# Altium schematic sheet power_supply.SchDoc
size A4
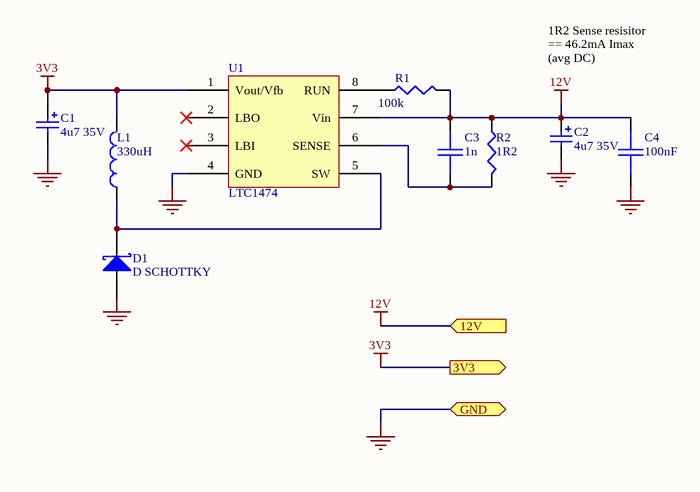
[diagram p0: power_supply.SchDoc]

## Parts
C1  4u7 35V  [MCCT-CASEC]
C2  4u7 35V  [MCCT-CASEC]
C3  1n  [0603]
C4  100nF  [0603]
D1  D SCHOTTKY  [SMB]
L1  330uH  [1812]
R1  100k  [0603]
R2  1R2  [0603]
U1  LTC1474  [SO8]

## Ports
3V3, 12V, GND

## Nets
3V3: C1.1 L1.2 U1.1(Vout/Vfb) ; port 3V3
12V: C2.1 C3.1 C4.1 R1.2 R2.1 U1.7(Vin) ; port 12V
GND: C1.2 C2.2 C4.2 D1.A U1.4(GND) ; port GND
NetC3_2: C3.2 R2.2 U1.6(SENSE)
NetD1_K: D1.K L1.1 U1.5(SW)
NetR1_1: R1.1 U1.8(RUN)

Not connected (* = marked no-connect by the designer): U1 2(LBO)* 3(LBI)*

## Notes on the sheet
- 1R2 Sense resisitor == 46.2mA Imax (avg DC)

## Library data of the parts
C1 C2 = Cap Pol3: Polarized Capacitor (Surface Mount); Value: 4.7uF; Order#: 197609; Revision: July-2002: Re-released for DXP Platform.; Price: 1.41; Supplier: Farnell
C3 = CAP: Capacitor; Value: 1nF; Order#: 317-202; Revision: July-2002: Re-released for DXP Platform.; Price: 0.12; Supplier: Farnell
C4 = CAP: Capacitor; Value: 0.1uF; Order#: 753-567; Revision: July-2002: Re-released for DXP Platform.; Price: 0.13; Supplier: Farnell
D1 = D SCHOTTKY: Schottky Diode; Manufacturer: Generic Components; Class I: Discrete; Class II: Diode - Schottky; Published: 8-Jun-2000; Revision: July-2002: Re-released for DXP Platform.; Publisher: Altium Limited
L1 = Inductor: Order#: 8808538; Revision: July-2002: Re-released for DXP Platform.; Value: 330uH; Price: 1.96; Supplier: Farnell
R1 = RES1: Resistor; Order#: 9331719; Value: 100k; Price: 0.05; Supplier: Farnell
R2 = RES1: Resistor; Value: 1.2R; Order#: 139-9658; Revision: July-2002: Re-released for DXP Platform.; Price: 0.515; Supplier: Farnell
U1 = LTC1474: Step-down converter; Order#: LTC1474CMS8-3.3-ND; Supplier: Digikey; Price: 7.42